# EAGLE design poor_man_DWM1001 (EAGLE 9.6.2)
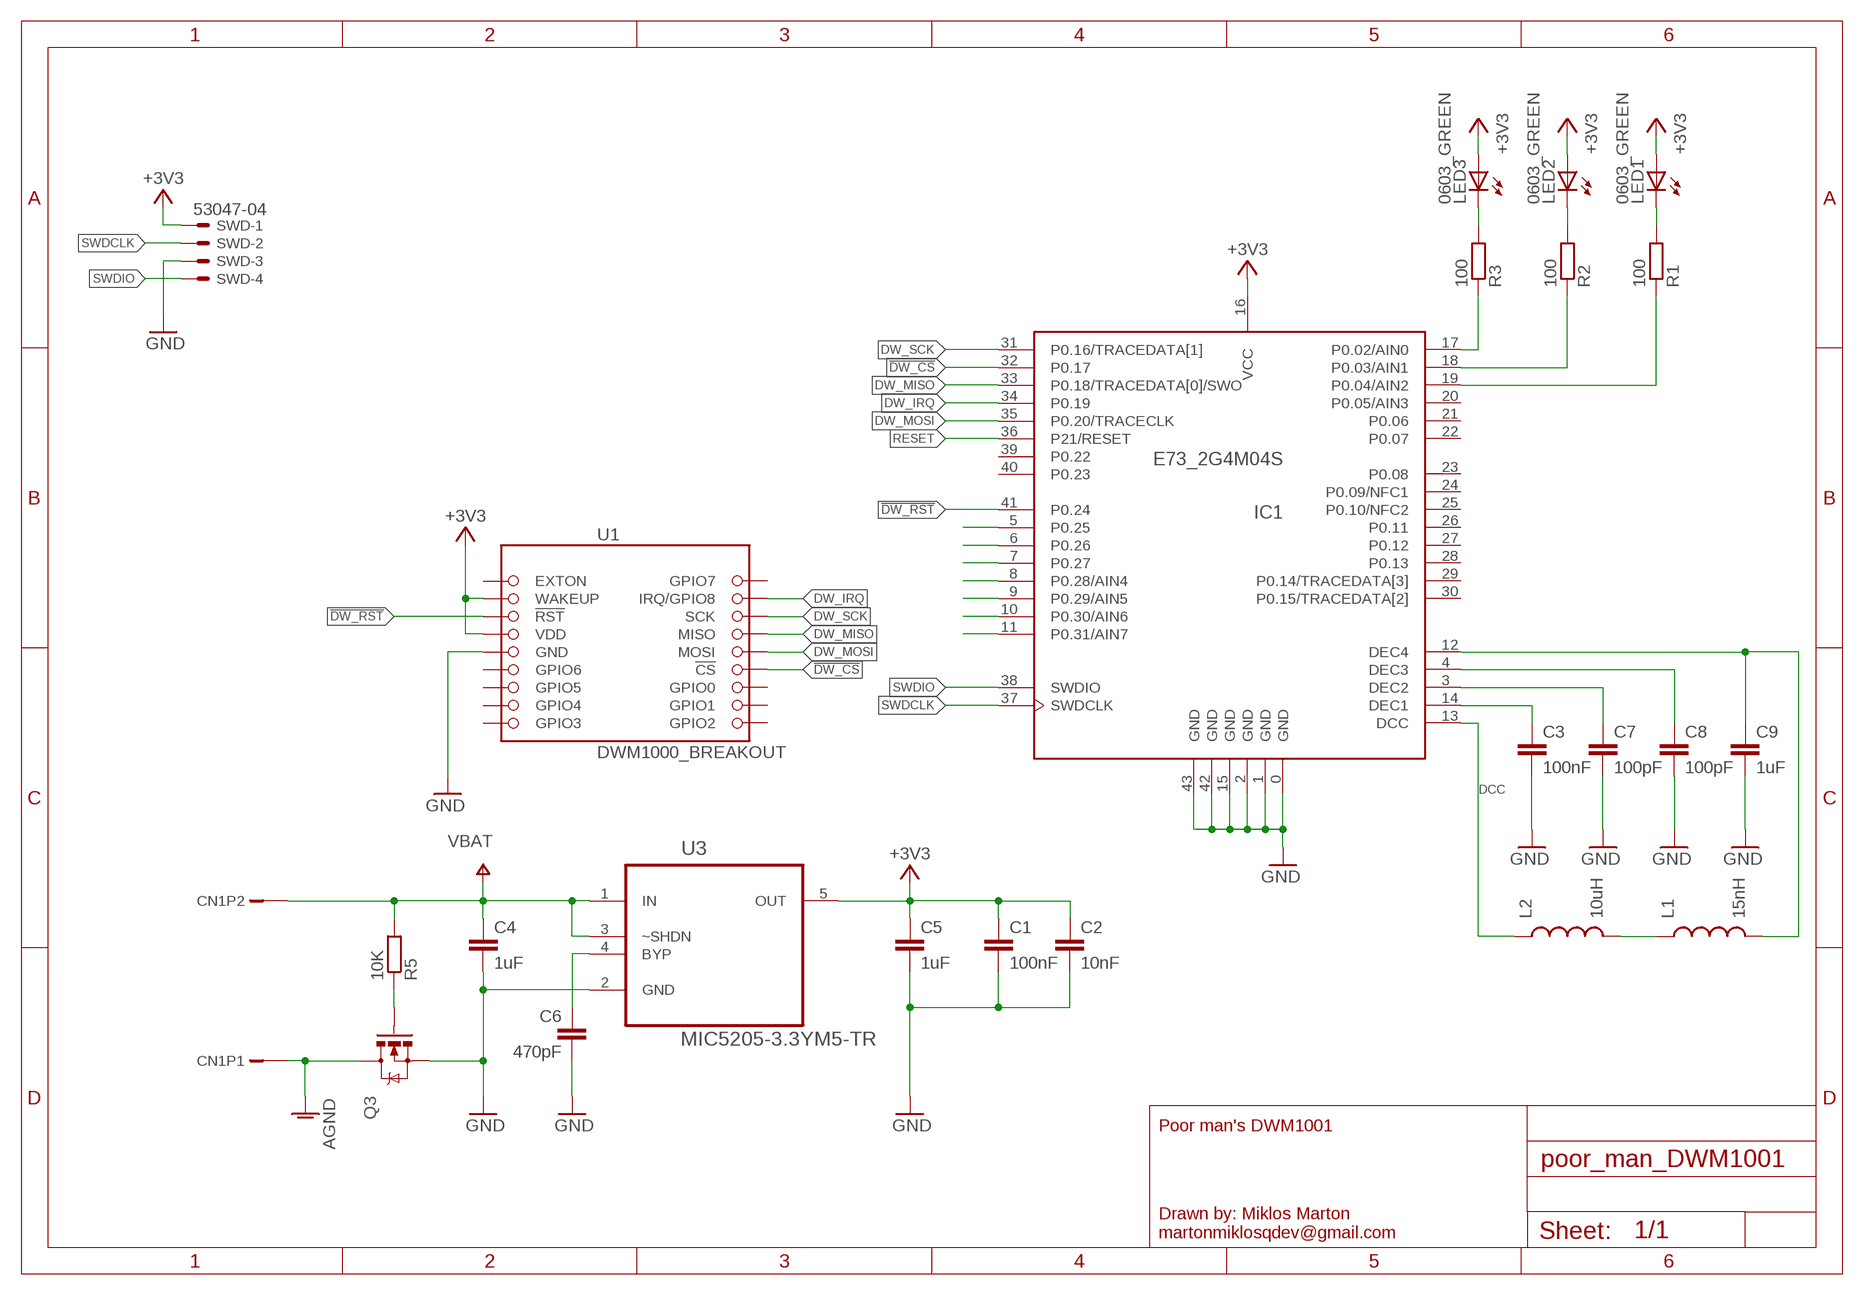
[diagram p0: schematic, sheet 1]

## Parts
C1  100nF  C-EUC0603  [C0603]
C2  10nF  C-EUC0603  [C0603]
C3  100nF  C-EUC0603  [C0603]
C4  1uF  C-EUC0603  [C0603]
C5  1uF  C-EUC0603  [C0603]
C6  470pF  C-EUC0603  [C0603]
C7  100pF  C-EUC0603  [C0603]
C8  100pF  C-EUC0603  [C0603]
C9  1uF  C-EUC0603  [C0603]
CN1  B2B-PH-K-S  [B2B-PH-K-S]
IC1  E73_2G4M04S  [E73_2G4M04S]
L1  15nH  SPARKFUN_INDUCTOR0402  [SPARKFUN_C0402]
L2  10uH  SPARKFUN_INDUCTOR0603  [SPARKFUN_0603]
LED1  0603_GREEN  LEDCHIP-LED0603  [CHIP-LED0603]
LED2  0603_GREEN  LEDCHIP-LED0603  [CHIP-LED0603]
LED3  0603_GREEN  LEDCHIP-LED0603  [CHIP-LED0603]
Q3  MOSFET-NCHANNELSMD  [SOT23-3]
R1  100  R-EU_R0603  [R0603]
R2  100  R-EU_R0603  [R0603]
R3  100  R-EU_R0603  [R0603]
R5  10K  R-EU_R0603  [R0603]
SWD  53047-04  [53047-04]
U1  DWM1000_BREAKOUT  [DWM1000_BREAKOUT]
U3  MIC5205-3.3YM5-TR  LT1761ES5-3.3TRMPBF  [SOT95P280X145-5N]

## Nets
!DW_CS: IC1.32(P0.17) U1.6(!CS)
!DW_RST: IC1.41(P0.24) U1.16(!RST)
+3V3: C1.1 C2.1 C5.1 IC1.16(VCC) LED1.A LED2.A LED3.A SWD.1 U1.15(VDD) U1.17(WAKEUP) U3.5(OUT)
AGND: CN1.1 Q3.3(D)
ANTISTUPID_GATE: Q3.1(G) R5.1
DCC: IC1.13(DCC) L2.1
DEC1: C3.1 IC1.14(DEC1)
DEC2: C7.1 IC1.3(DEC2)
DEC3: C8.1 IC1.4(DEC3)
DEC4: C9.1 IC1.12(DEC4) L1.2
DW_IRQ: IC1.34(P0.19) U1.2(IRQ/GPIO8)
DW_MISO: IC1.33(P0.18/TRACEDATA[0]/SWO) U1.4(MISO)
DW_MOSI: IC1.35(P0.20/TRACECLK) U1.5(MOSI)
DW_SCK: IC1.31(P0.16/TRACEDATA[1]) U1.3(SCK)
GND: C1.2 C2.2 C3.2 C4.2 C5.2 C6.2 C7.2 C8.2 C9.2 IC1.0(GND) IC1.1(GND) IC1.2(GND) IC1.15(GND) IC1.42(GND) IC1.43(GND) Q3.2(S) SWD.3 U1.14(GND) U3.2(GND)
GPIO_LED1: IC1.19(P0.04/AIN2) R1.1
GPIO_LED1_R: LED1.C R1.2
GPIO_LED2: IC1.18(P0.03/AIN1) R2.1
GPIO_LED2_R: LED2.C R2.2
GPIO_LED3: IC1.17(P0.02/AIN0) R3.1
GPIO_LED3_R: LED3.C R3.2
MIC_BYPASS: C6.1 U3.4(BYP)
N$6: IC1.5(P0.25)
N$7: IC1.6(P0.26)
N$8: IC1.7(P0.27)
N$9: IC1.8(P0.28/AIN4)
N$10: IC1.9(P0.29/AIN5)
N$11: IC1.10(P0.30/AIN6)
N$12: IC1.11(P0.31/AIN7)
N$13: L1.1 L2.2
RESET: IC1.36(P21/RESET)
SWDCLK: IC1.37(SWDCLK) SWD.2
SWDIO: IC1.38(SWDIO) SWD.4
VBAT: C4.1 CN1.2 R5.2 U3.1(IN) U3.3(~SHDN)
Unconnected: IC1.20(P0.05/AIN3) IC1.21(P0.06) IC1.22(P0.07) IC1.23(P0.08) IC1.24(P0.09/NFC1) IC1.25(P0.10/NFC2) IC1.26(P0.11) IC1.27(P0.12) IC1.28(P0.13) IC1.29(P0.14/TRACEDATA[3]) IC1.30(P0.15/TRACEDATA[2]) IC1.39(P0.22) IC1.40(P0.23) U1.1(GPIO7) U1.7(GPIO0) U1.8(GPIO1) U1.9(GPIO2) U1.10(GPIO3) U1.11(GPIO4) U1.12(GPIO5) U1.13(GPIO6) U1.18(EXTON)

## Library data of the parts
C1-C9 = rcl:C-EU: CAPACITOR, European symbol
CN1 = con-jst:B2B-PH-K-S; OC_TME: B2B-PH-K-S
IC1 = E73-2G4M04S:E73_2G4M04S: E73-2G4M04S nRF52832 based BLE module
L1 L2 = 3DR-GPS-LEA6-JST-v11-RELEASE:SPARKFUN_INDUCTOR: Inductors Basic Inductor/Choke - 0603 and 1206. Footprints are not proven and vary greatly between part numbers.
LED1-LED3 = led:LED: LED OSRAM: - CHIPLED LG R971, LG N971, LY N971, LG Q971, LY Q971, LO R971, LY R971 LH N974, LH R974 LS Q976, LO Q976, LY Q976 LO Q996 - Hyper CHIPLED LW Q18S LB Q993, LB Q99A, LB R99A - SideLED LS A670, LO A670, LY A670, LG A670, LP A670 LB A673, LV A673, LT A673, LW A673 LH A674 LY A675 LS A676, LA A676, LO A676, LY A676, LW A676 LS A679, LY A679, LG A679 - Hyper Micro SIDELED® LS Y876, LA Y876, LO Y876, LY Y876 LT Y87S - SmartLED LW L88C, LW L88S LB L89C, LB L89S, LG L890 LS L89K, LO L89K, LY L89K LS L896, LA L896, LO L896, LY L896 - TOPLED LS T670, LO T670, LY T670, LG T670, LP T670 LSG T670, LSP T670, LSY T670, LOP T670, LYG T670 LG T671, LOG T671, LSG T671 LB T673, LV T673, LT T673, LW T673 LH T674 LS T676, LA T676, LO T676, LY T676, LB T676, LH T676, LSB T676, LW T676 LB T67C, LV T67C, LT T67C, LS T67K, LO T67K, LY T67K, LW E67C LS E67B, LA E67B, LO E67B, LY E67B, LB E67C, LV E67C, LT E67C LW T67C LS T679, LY T679, LG T679 LS T770, LO T770, LY T770, LG T770, LP T770 LB T773, LV T773, LT T773, LW T773 LH T774 LS E675, LA E675, LY E675, LS T675 LS T776, LA T776, LO T776, LY T776, LB T776 LHGB T686 LT T68C, LB T68C - Hyper Mini TOPLED® LB M676 - Mini TOPLED Santana® LG M470 LS M47K, LO M47K, LY M47K Source: http://www.osram.convergy.de LUXEON: - LUMILED® LXK2-PW12-R00, LXK2-PW12-S00, LXK2-PW14-U00, LXK2-PW14-V00 LXK2-PM12-R00, LXK2-PM12-S00, LXK2-PM14-U00 LXK2-PE12-Q00, LXK2-PE12-R00, LXK2-PE12-S00, LXK2-PE14-T00, LXK2-PE14-U00 LXK2-PB12-K00, LXK2-PB12-L00, LXK2-PB12-M00, LXK2-PB14-N00, LXK2-PB14-P00, LXK2-PB14-Q00 LXK2-PR12-L00, LXK2-PR12-M00, LXK2-PR14-Q00, LXK2-PR14-R00 LXK2-PD12-Q00, LXK2-PD12-R00, LXK2-PD12-S00 LXK2-PH12-R00, LXK2-PH12-S00 LXK2-PL12-P00, LXK2-PL12-Q00, LXK2-PL12-R00 Source: www.luxeon.com KINGBRIGHT: KA-3528ASYC Source: www.kingbright.com
Q3 = SparkFun:MOSFET-NCHANNEL
R1-R3 R5 = rcl:R-EU_: RESISTOR, European symbol
SWD = con-molex:53?-04: CONNECTOR wire to board 1.25 mm (.049 inch) pitch header; MF: WALDOM/MOLEX; MPN: 53047-0410; OC_FARNELL: 9733060; OC_NEWARK: 38C9900
U1 = martonmiklos:DWM1000_BREAKOUT
U3 = LTC_By_element14_Batch_1:LT1761ES5-3.3TRMPBF: 100mA, Low Noise, LDO Micropower Regulators; MPN: LT1761ES5-3.3#TRMPBF; OC_FARNELL: 1663779; OC_NEWARK: 19P0920; OC_TME: MIC5205-3.3YM5-TR; PACKAGE: SOT-23-5; SUPPLIER: Linear Technology

## Board
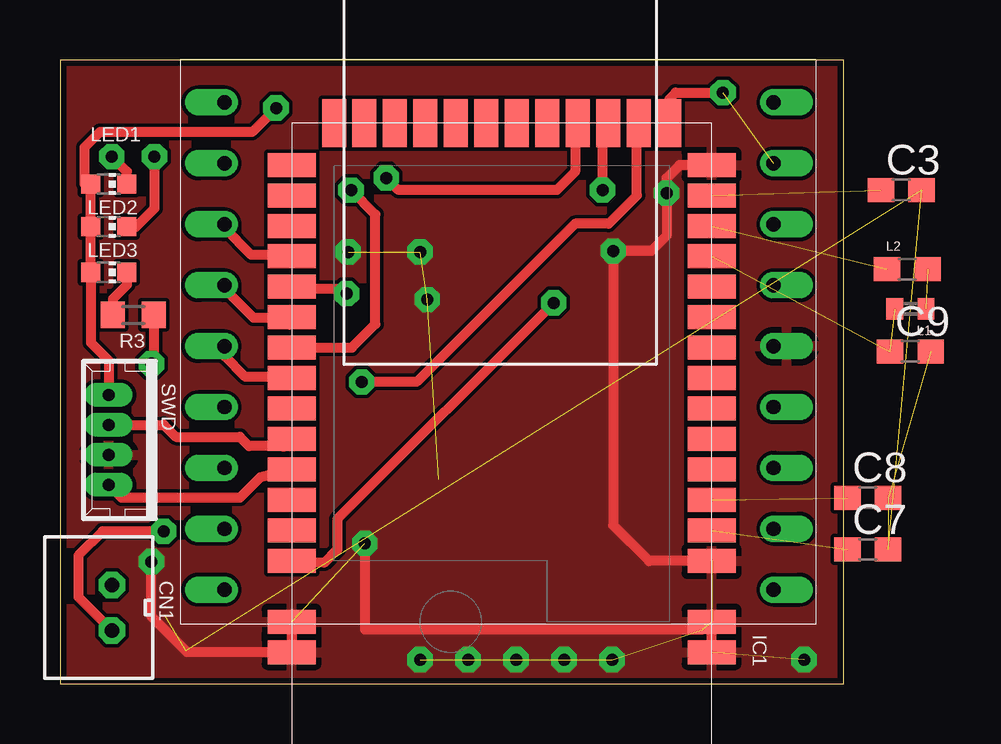
[diagram p1: board, top side]
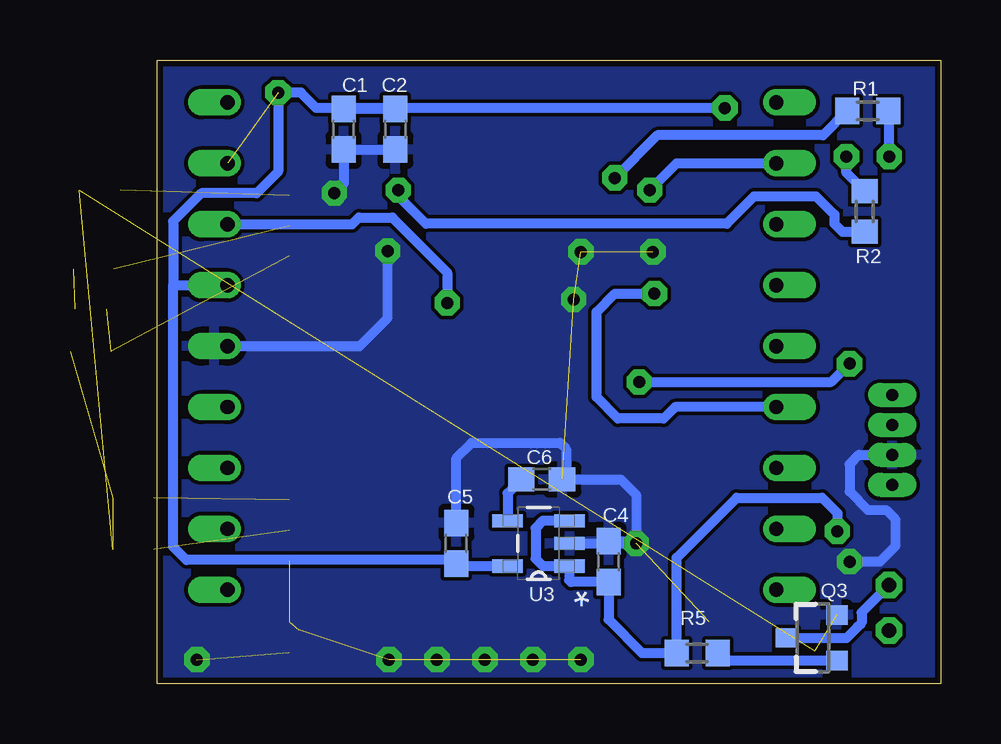
[diagram p2: board, bottom side, seen from below]

Size 32.65 x 26 mm. Coordinates in mm from the lower left corner, seen from the top.
Outline: 0,0 32.65,0 32.65,26 0,26 0,0
Copper layers (1*16): Top 0.035mm / dielectric 1.5mm / Bottom 0.035mm
Design rules "dirt_cheap_dirty_boards.v1 *": minimum track width 5mil, minimum drill 0.3mm, track to track 6mil, track to pad 6mil, pad to pad 6mil, via to via 6mil, smd to smd 0mil, copper to edge 10mil, drill to drill 10mil, minimum pad ring 10mil, minimum via ring 6mil, stop-mask expansion 2mil, vias tented up to drill 25mil, thermal gap 10mil

### Footprints (pad centres in the part's own frame; a part is rotated, then mirrored left to right if it is on the bottom)
C0603 = smd 1.1 x 1: 1 -0.85,0; 2 0.85,0
B2B-PH-K-S = drill 0.6 pad 1.016 octagon: 1 1.95,0; 2 0.05,0
E73_2G4M04S = smd 1 x 2: 0 22.065,17.5; 1 20.795,17.5; 2 18.255,17.5; 3 16.985,17.5; 4 15.715,17.5; 5 14.445,17.5; 6 13.175,17.5; 7 11.905,17.5; 8 10.635,17.5; 9 9.365,17.5; 10 8.095,17.5; 11 6.825,17.5; 12 5.555,17.5; 13 4.285,17.5; 14 3.015,17.5; 15 1.745,17.5; 28 1.745,0; 29 3.015,0; 30 4.285,0; 31 5.555,0; 32 6.825,0; 33 8.095,0; 34 9.365,0; 35 10.635,0; 36 11.905,0; 37 13.175,0; 38 14.445,0; 39 15.715,0; 40 16.985,0; 41 18.255,0; 42 20.795,0; 43 22.065,0 | smd 2 x 1: 16 0,15.735; 17 0,14.465; 18 0,13.195; 19 0,11.925; 20 0,10.655; 21 0,9.385; 22 0,8.115; 23 0,6.845; 24 0,5.575; 25 0,4.305; 26 0,3.035; 27 0,1.765
SPARKFUN_C0402 = smd 0.7 x 0.9: 1 -0.65,0; 2 0.65,0
SPARKFUN_0603 = smd 1.1 x 1: 1 -0.85,0; 2 0.85,0
CHIP-LED0603 = smd 0.8 x 0.8: A 0,-0.75; C 0,0.75
SOT23-3 = smd 0.8 x 0.9: 1 -0.95,-1; 2 0.95,-1; 3 0,1.1
R0603 = smd 1 x 1.1: 1 -0.85,0; 2 0.85,0
53047-04 = drill 0.5 pad 0.698 long: 1 1.875,0.45; 2 0.625,0.45; 3 -0.625,0.45; 4 -1.875,0.45
DWM1000_BREAKOUT = drill 0.6 offset: 1 1.862,21.73; 2 1.862,19.19; 3 1.862,16.65; 4 1.862,14.11; 5 1.862,11.57; 6 1.862,9.03; 7 1.862,6.49; 8 1.862,3.95; 9 1.862,1.41; 10 24.722,1.41; 11 24.722,3.95; 12 24.722,6.49; 13 24.722,9.03; 14 24.722,11.57; 15 24.722,14.11; 16 24.722,16.65; 17 24.722,19.19; 18 24.722,21.73
SOT95P280X145-5N = smd 1.27 x 0.559: 1 -1.295,0.94; 2 -1.295,0; 3 -1.295,-0.94; 4 1.295,-0.94; 5 1.295,0.94

### Placement (x,y rotation side)
C1  24.89,23.11 270 bottom
C2  22.73,23.11 270 bottom
C3  35.05,20.57 0 top
C4  13.84,5.08 90 bottom
C5  20.19,5.84 90 bottom
C6  16.64,8.51 0 bottom
C7  33.66,5.59 0 top
C8  33.66,7.75 0 top
C9  35.43,13.84 0 top
CN1  2.16,2.16 90 top
IC1  9.65,23.37 270 top
L1  35.43,15.62 180 top
L2  35.31,17.27 0 top
LED1  2.03,20.83 270 top
LED2  2.03,19.05 270 top
LED3  2.03,17.14 270 top
Q3  5.33,1.91 90 bottom
R1  3.05,23.88 0 bottom
R2  3.17,19.68 90 bottom
R3  3.05,15.37 180 top
R5  10.16,1.27 180 bottom
SWD  2.48,10.16 90 top
U1  5,2.5 0 top
U3  16.76,5.84 180 bottom

### Tracks (layer width: path | path; a pad name or v marks a point on that pad's centre or on a via)
!DW_CS  (via drill 0.5 pad 1.05)
  Top 0.406: IC1.32 9.65,16.47 11.72,16.47 v11.94,16.26
  Bottom 0.406: U1.6 11.08,11.53 11.56,11.05 13.46,11.05 14.35,11.94 14.35,15.49 13.59,16.26 v11.94,16.26
!DW_RST  (via drill 0.5 pad 1.05)
  Top 0.406: v20.57,15.88 11.56,6.86 11.56,5.59 11.01,5.04 11,5.05 IC1.41
  Bottom 0.406: U1.16 24.54,19.15 24.26,19.43 22.86,19.43 20.57,17.14 v20.57,15.88
+3V3  (via drill 0.5 pad 1.05)  (1 unrouted)
  Top 0.406: v9,24 8,23 1.66,23 1.02,22.35 1.02,20.84 LED1.A LED2.A LED3.A 1.28,14.21 2.03,13.47 SWD.1 | IC1.16 25.4,23.38 25.4,24.38 25.65,24.64 v27.62,24.64
  Bottom 0.406: v9,24 22.86,24 | 22.86,24 26.03,24 26.67,24.64 v27.62,24.64 27.62,21.34 28.51,20.45 30.82,20.45 31.99,19.28 31.99,16.61 | 31.11,16.64 31.09,16.61 | 31.09,16.61 U1.15 | U3.5 19.98,4.9 20.07,4.99 C5.1 20.19,5.07 20.1,5.16 31.45,5.16 31.99,5.7 31.99,16.61 | 31.99,16.61 31.09,16.61 | C1.1 22.9,23.96 22.86,24 | C2.1 22.82,23.96 22.86,24
AGND
  Bottom 0.406: Q3.3 3.93,1.91 3.53,2.31 3.3,2.54 3.3,2.97 CN1.1
ANTISTUPID_GATE
  Bottom 0.406: Q3.1 8.99,0.95 R5.1
DCC  (1 unrouted)
DEC1  (1 unrouted)
DEC2  (1 unrouted)
DEC3  (1 unrouted)
DEC4  (2 unrouted)
DW_IRQ  (via drill 0.5 pad 1.05)
  Top 0.406: v12.13,20.57 13.14,19.56 13.14,14.99 12.16,14 IC1.34
  Bottom 0.406: v12.13,20.57 11.01,21.69 U1.2
DW_MISO
  Top 0.406: U1.4 6.86,16.44 8.06,15.24 9.28,15.24 9.56,14.95 IC1.33
DW_MOSI
  Top 0.406: U1.5 6.86,13.65 7.72,12.79 9.6,12.79 IC1.35
DW_SCK
  Top 0.406: U1.3 6.86,18.98 7.98,17.87 9.6,17.87 IC1.31
GND  (via drill 0.5 pad 1.05)  (17 unrouted)
  Top 0.406: 26.75,2.25 12.7,2.25 v12.7,5.84 | 5.25,1.36 4.7,1.91 | 4.7,1.91 3.81,2.79 v3.81,5.08 | IC1.2 24.56,5.11 24.55,5.11 23.05,6.6 v23.05,18.03 24.64,18.03 25.27,18.67 v25.27,20.45 25.27,21.08 25.81,21.62 IC1.15 27.22,21.69 | IC1.42 IC1.43 5.3,1.3 4.7,1.91 | IC1.0 IC1.1
  Bottom 0.406: U1.14 24.22,14.07 23.05,15.24 v23.05,18.03 | SWD.3 3.42,9.54 3.81,9.14 3.81,8 3.05,7.24 2.29,7.24 1.91,6.86 1.91,5.71 2.54,5.08 v3.81,5.08 | U3.2 v12.7,5.84 | C6.2 15.62,8.51 | 15.62,8.51 13.33,8.51 12.7,7.87 v12.7,5.84 | C5.2 20.19,9.4 19.56,10.03 15.88,10.03 15.62,9.78 15.62,8.51 | v12.7,5.84 12.83,5.71 13.04,5.93 C4.2 | C2.2 C1.2 24.89,20.83 v25.27,20.45
  other vias: 21,1 19,1 17,1 15,1 23,1 31,1 15,18 12,18 15.3,16.02
  pour Top: 0,26 0,0 33,0 33,26
  pour Bottom: 0,26 0,0 33,0 33,26
GPIO_LED1  (via drill 0.5 pad 1.05)
  Top 0.152: IC1.19 21.54,23.33 21.46,23.33
  Top 0.406: v13.59,21.08 14.1,20.57 20.7,20.57 21.46,21.34 21.46,23.33
  Bottom 0.406: R1.1 4.91,22.86 11.81,22.86 v13.59,21.08
GPIO_LED1_R  (via drill 0.5 pad 1.05)
  Top 0.406: LED1.C 2.78,21.35 v2.16,21.97
  Bottom 0.406: v2.16,21.97 2.16,23.84 R1.2
GPIO_LED2  (via drill 0.5 pad 1.05)
  Top 0.406: 22.77,20.73 arc-90 v22.61,20.57 22.61,23.13 IC1.18
  Bottom 0.406: v22.61,20.57 22.61,20.32 21.46,19.18 8.92,19.18 7.78,20.32 5.21,20.32 4.44,19.56 4.44,19.18 4.1,18.84 R2.1
GPIO_LED2_R  (via drill 0.5 pad 1.05)
  Top 0.406: v3.94,21.97 3.94,19.81 3.17,19.05 LED2.C
  Bottom 0.406: R2.2 3.94,21.3 v3.94,21.97
GPIO_LED3  (via drill 0.5 pad 1.05)
  Top 0.406: v12.57,12.57 14.86,12.57 21.46,19.18 22.86,19.18 24.04,20.35 24.04,23.29 IC1.17 | R3.1 3.9,13.42 v3.81,13.34
  Bottom 0.406: v12.57,12.57 4.57,12.57 v3.81,13.34
GPIO_LED3_R
  Top 0.406: LED3.C 2.78,16.62 2.2,16.04 R3.2
MIC_BYPASS
  Bottom 0.406: C6.1 18.06,7.94 U3.4
N$13  (1 unrouted)
SWDCLK
  Top 0.406: 9.53,9.91 9.27,9.91 | 9.27,9.91 7.87,9.91 7.49,10.29 4.83,10.29 4.33,10.79 SWD.2 | IC1.37 9.3,9.87 9.27,9.91
SWDIO
  Top 0.406: SWD.4 2.56,7.75 7.49,7.75 8.35,8.6 IC1.38
VBAT  (via drill 0.5 pad 1.05)
  Top 0.406: v4.32,6.35 1.78,6.35 0.76,5.33 0.76,3.61 CN1.2
  Bottom 0.406: U3.3 16.59,6.78 16.89,6.48 16.89,5.21 16.59,4.9 15.75,4.9 | 15.75,4.9 U3.1 15.47,4.34 15.49,4.32 15.41,4.23 C4.1 13.84,2.67 12.45,1.27 R5.2 11.01,5.25 8.51,7.75 4.95,7.75 4.5,7.29 4.37,7.16 4.32,7.11 v4.32,6.35 | 15.79,4.86 15.75,4.9